# EAGLE design schematic1 (EAGLE 7.2.0)
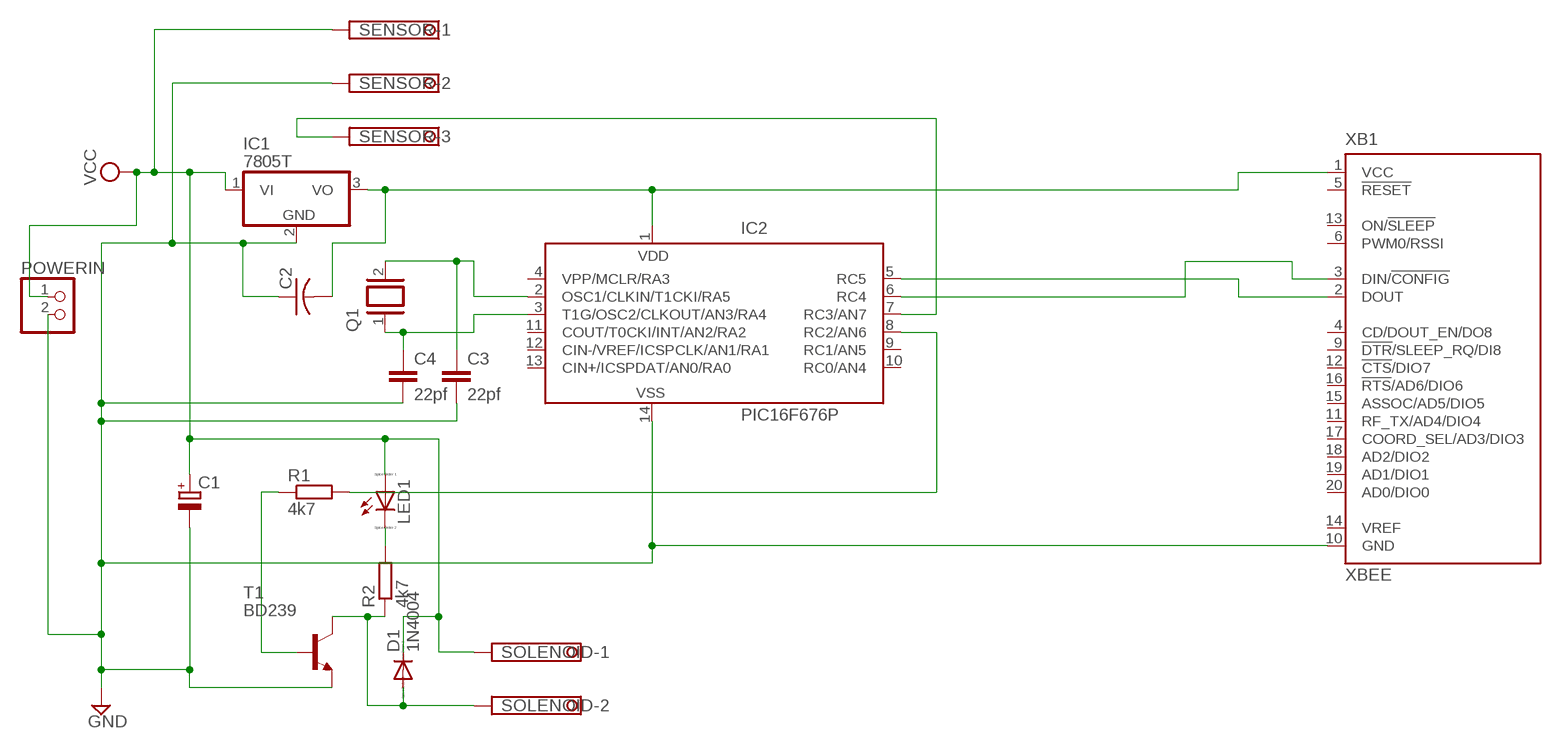
[diagram p0: schematic, sheet 1]

## Parts
C1  CPOL-EUE3.5-8  [E3,5-8]
C2  C-US050-024X044  [C050-024X044]
C3  22pf  C-EU025-025X050  [C025-025X050]
C4  22pf  C-EU025-025X050  [C025-025X050]
D1  1N4004  [DO41-10]
IC1  7805T  [TO220H]
IC2  PIC16F676P  [DIL14]
LED1  LED_ELD260  [LED_LD260]
POWERIN  PINHD-1X2  [1X02]
Q1  XTAL  [Q]
R1  4k7  R-EU_0207/15  [0207/15]
R2  4k7  R-EU_0207/15  [0207/15]
SENSOR  1751251  [1751251]
SOLENOID  1751248  [1751248]
T1  BD239  [TO220]
XB1  XBEE  [XBEE]

## Nets
GND: C1.- C2.1 C3.2 C4.2 IC1.2(GND) IC2.14(VSS) POWERIN.2 SENSOR.2 T1.3(E) XB1.10(GND)
N$1: C2.2 IC1.3(VO) IC2.1(VDD) XB1.1(VCC)
N$2: IC2.8(RC2/AN6) R1.2
N$3: C3.1 IC2.2(OSC1/CLKIN/T1CKI/RA5) Q1.2
N$4: C4.1 IC2.3(T1G/OSC2/CLKOUT/AN3/RA4) Q1.1
N$5: IC2.5(RC5) XB1.2(DOUT)
N$6: IC2.6(RC4) XB1.3(DIN/!CONFIG)
N$7: D1.A R2.1 SOLENOID.2 T1.2(C)
N$8: R1.1 T1.1(B)
N$13: LED1.K(C) R2.2
REGULATOR: IC2.7(RC3/AN7) SENSOR.3
VCC: C1.+ D1.C IC1.1(VI) LED1.A POWERIN.1 SENSOR.1 SOLENOID.1
Unconnected: IC2.4(VPP/MCLR/RA3) IC2.9(RC1/AN5) IC2.10(RC0/AN4) IC2.11(COUT/T0CKI/INT/AN2/RA2) IC2.12(CIN-/VREF/ICSPCLK/AN1/RA1) IC2.13(CIN+/ICSPDAT/AN0/RA0) XB1.4(CD/DOUT_EN/DO8) XB1.5(!RESET) XB1.6(PWM0/RSSI) XB1.9(!DTR!/SLEEP_RQ/DI8) XB1.11(RF_TX/AD4/DIO4) XB1.12(!CTS!/DIO7) XB1.13(ON/!SLEEP) XB1.14(VREF) XB1.15(ASSOC/AD5/DIO5) XB1.16(!RTS!/AD6/DIO6) XB1.17(COORD_SEL/AD3/DIO3) XB1.18(AD2/DIO2) XB1.19(AD1/DIO1) XB1.20(AD0/DIO0)

## Library data of the parts
C1 = rcl:CPOL-EU: POLARIZED CAPACITOR, European symbol
C2 = rcl:C-US: CAPACITOR, American symbol
C3 C4 = rcl:C-EU: CAPACITOR, European symbol
D1 = diode:1N4004: DIODE general purpose rectifier, 1 A
IC1 = linear:78*: Positive VOLTAGE REGULATOR Source: http://cache.national.com/ds/LM/LM78L05.pdf http://www.fairchildsemi.com/ds/LM/LM7805.pdf
IC2 = microchip:PIC16F676: 14-Pin, Flash-Based 8-Bit CMOS Microcontroller High Performance RISC CPU: * Only 35 instructions to learn - All single-cycle instructions except branches * Operating speed: - DC - 20 MHz oscillator/clock input - DC - 200 ns instruction cycle * Internal and external oscillator options - Precision Internal 4 MHz oscillator factory calibrated to ±1% - External Oscillator support for crystals and resonators - 5?s wake-up from SLEEP, 3.0V, typical * Power saving SLEEP mode * Wide operating voltage range - 2.0V to 5.5V * Industrial and Extended temperature range * Low power Power-on Reset (POR) * Power-up Timer (PWRT) and Oscillator Start-up Timer (OST) * Brown-out Detect (BOD) * Watchdog Timer (WDT) with independent oscillator for reliable operation * Multiplexed MCLR/Input-pin * Interrupt-on-pin change * Individual programmable weak pull-ups * Programmable code protection * High Endurance FLASH/EEPROM Cell - 100,000 write FLASH endurance - 1,000,000 write EEPROM endurance - FLASH/Data EEPROM Retention: > 40 years * Standby Current: - 1 nA @ 2.0V, typical * Operating Current: - 8.5?A @ 32 kHz, 2.0V, typical - 100?A @ 1 MHz, 2.0V, typical * Watchdog Timer Current - 300 nA @ 2.0V, typical * Timer1 oscillator current: - 4?A @ 32 kHz, 2.0V, typical * 12 I/O pins with individual direction control * High current sink/source for direct LED drive * Analog-to-Digital Converter module (PIC16F676): - 10-bit resolution - Programmable 8-channel input - Voltage reference input * In-Circuit Serial ProgrammingTM (ICSPTM) via two pins Source: http://ww1.microchip.com/downloads/en/DeviceDoc/40039E.pdf; MF: MICROCHIP; MPN: PIC16F676-I/P; OC_FARNELL: 9760512; OC_NEWARK: 54K2829
LED1 = eagle-ltspice:LED_E: LED Source: http://www.osram.convergy.de Source: www.luxeon.com Source: www.kingbright.com; SPICEMODEL: NONE; SPICEPREFIX: D; SPICETYPE: diode
POWERIN = pinhead:PINHD-1X2: PIN HEADER
Q1 = special:XTAL: CRYSTAL
R1 R2 = resistor:R-EU_: RESISTOR, European symbol
SENSOR = con-phoenix-350:1751251: MKDS 1/ 3-3,5 Printklemme Nennstrom: 10 A Bemessungsspannung: 160 V Raster: 3,5 mm Polzahl: 3 Montageart: Löten Anschlussart: Schraubanschluss Anschlussrichtung vom Leiter zur Platine: 0° Source: http://eshop.phoenixcontact.com .. 1751251.pdf; OC_FARNELL: unknown; OC_NEWARK: unknown
SOLENOID = con-phoenix-350:1751248: MKDS 1/ 2-3,5 Printklemme Nennstrom: 10 A Bemessungsspannung: 160 V Raster: 3,5 mm Polzahl: 2 Montageart: Löten Anschlussart: Schraubanschluss Anschlussrichtung vom Leiter zur Platine: 0° Source: http://eshop.phoenixcontact.com .. 1751248.pdf; OC_FARNELL: unknown; OC_NEWARK: unknown
T1 = transistor-neu-to92:BD239: NPN TRANSISTOR Source: http://www.fairchildsemi.com/ds/BD/BD239C.pdf
XB1 = maxstream:XBEE: XBee (TM) /XBee-PRO(TM) OEM RF Modules Source: MaxStream, Inc. xbee_productmanual.pdf; MPN: XBP24-Z7UIT-004; OC_FARNELL: 1751799; OC_NEWARK: 34R5507

## Board
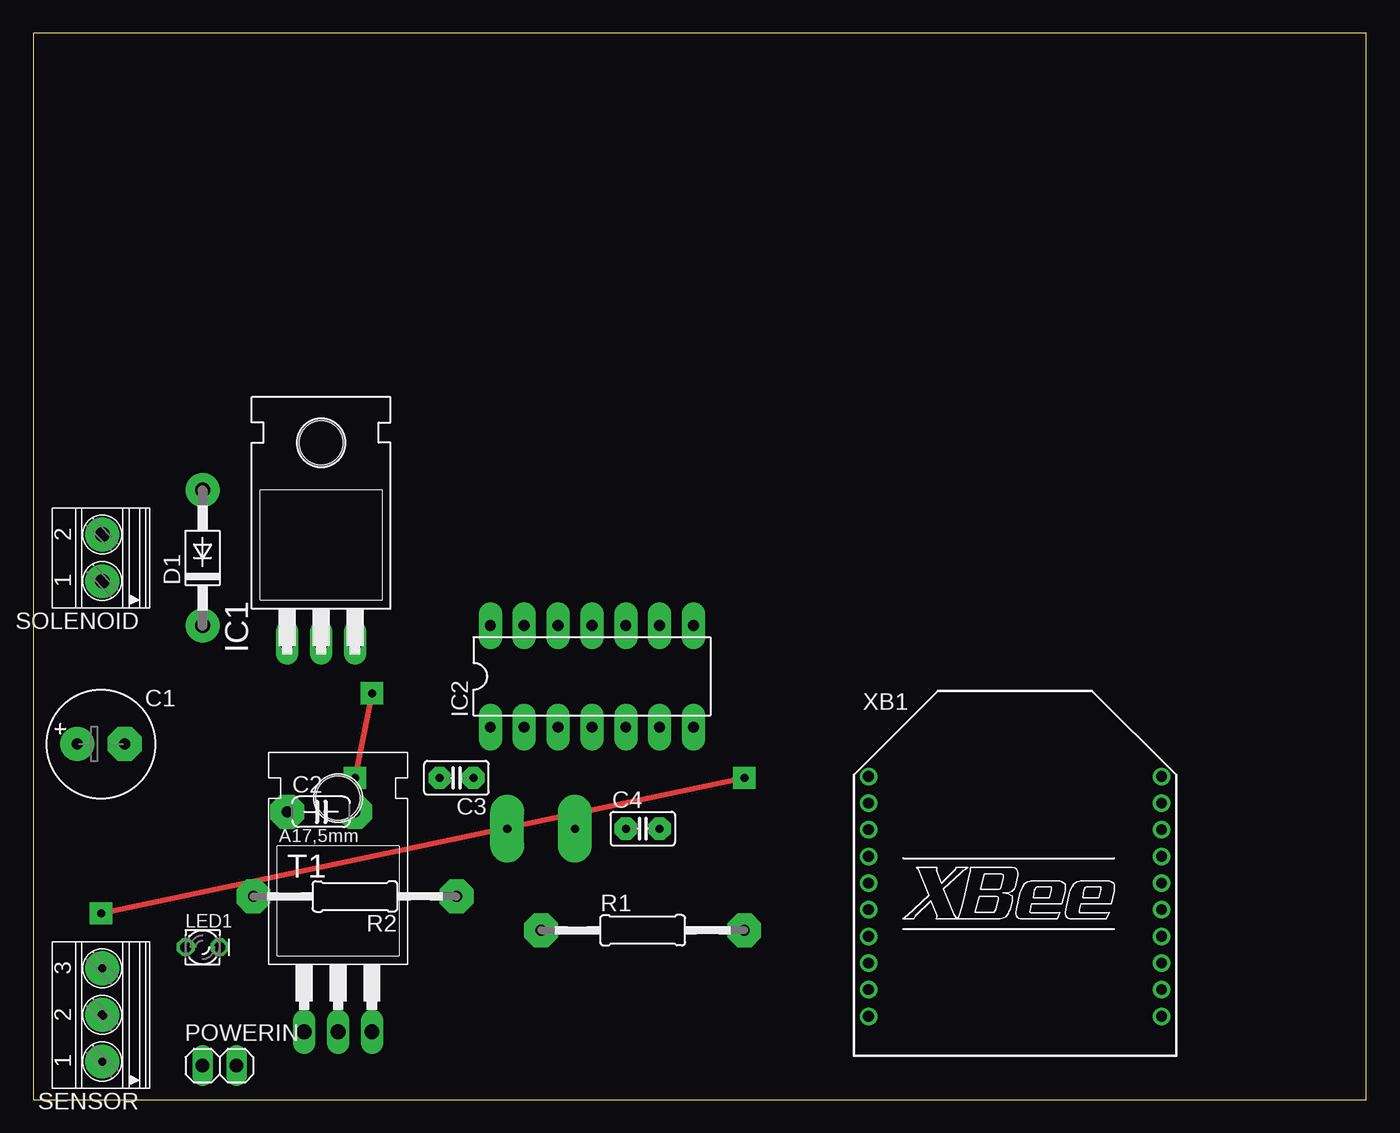
[diagram p1: board, top side]
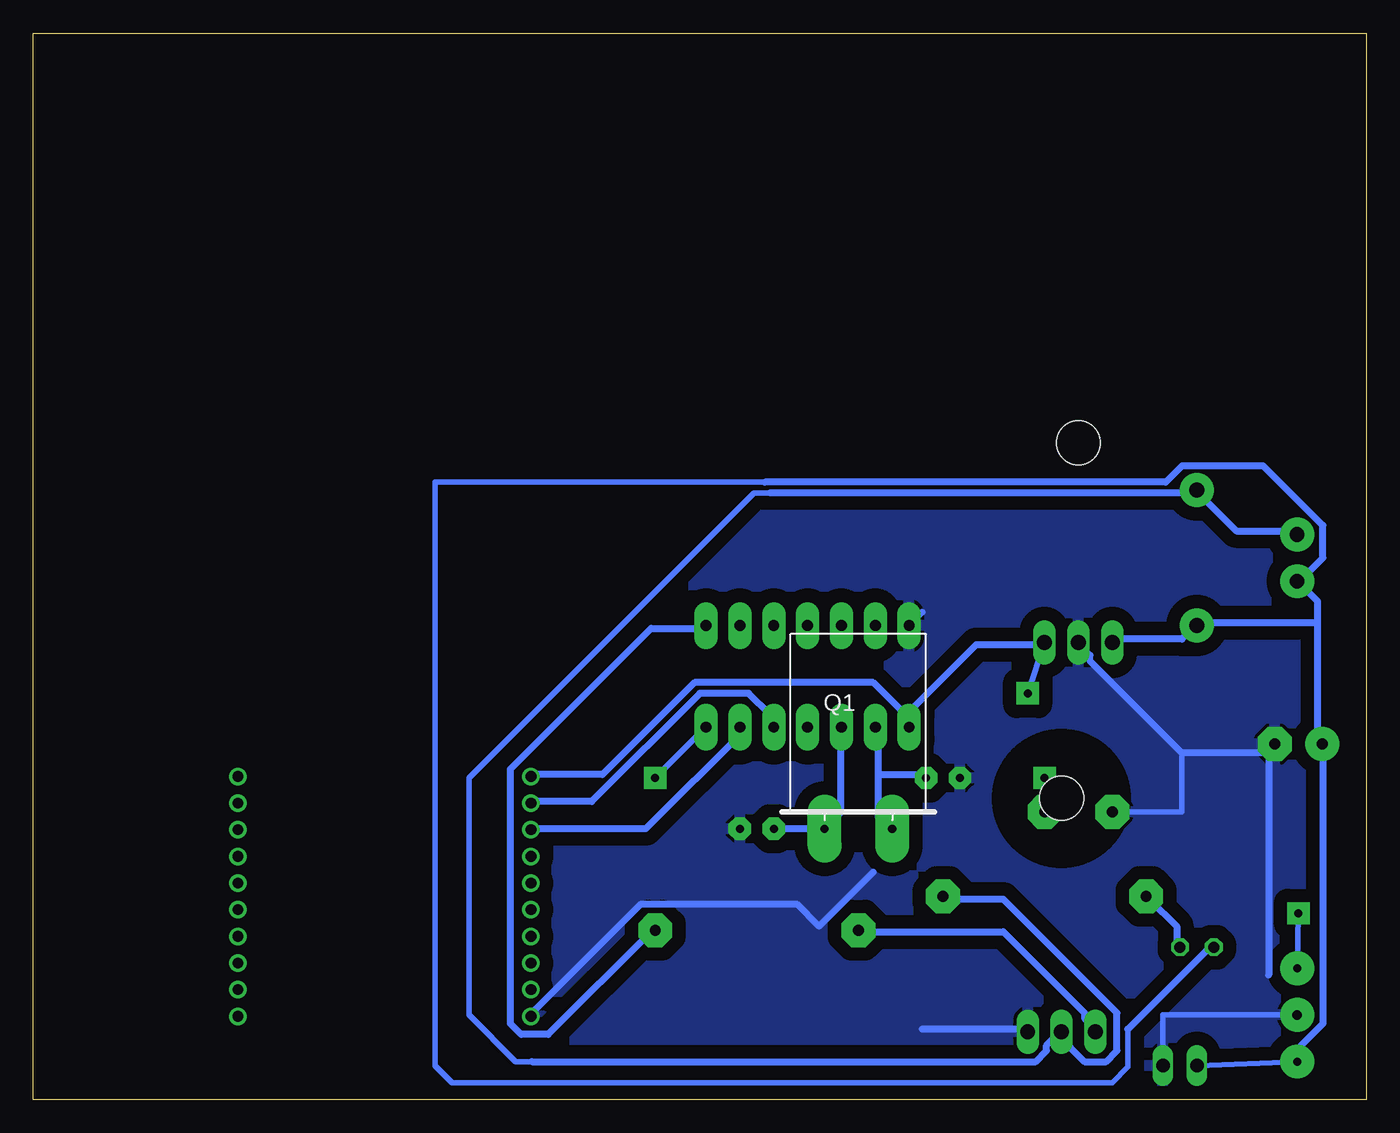
[diagram p2: board, bottom side, seen from below]

Size 100 x 80 mm. Coordinates in mm from the lower left corner, seen from the top.
Outline: 0,0 100,0 100,80 0,80 0,0
Copper layers (1*16): Top 0.035mm / dielectric 1.5mm / Bottom 0.035mm
Design rules "default *": minimum track width 20mil, minimum drill 14mil, track to track 12mil, track to pad 12mil, pad to pad 12mil, via to via 8mil, smd to smd 8mil, copper to edge 40mil, drill to drill 8mil, minimum pad ring 10mil, minimum via ring 8mil, stop-mask expansion 4mil, vias tented up to drill 0mil, thermal gap 10mil

### Footprints (pad centres in the part's own frame; a part is rotated, then mirrored left to right if it is on the bottom)
E3,5-8 = drill 0.813 pad 2.54: + -1.778,0 | drill 0.813 pad 2.54 octagon: - 1.778,0
C050-024X044 = drill 0.813 pad 2.54 octagon: 1 -2.54,0; 2 2.54,0
C025-025X050 = drill 0.6 pad 1.676 octagon: 1 -1.27,0; 2 1.27,0
DO41-10 = drill 1.118 pad 2.54: A 5.08,0; C -5.08,0
TO220H = drill 1.118 long: 1 -2.54,-10.16; 2 0,-10.16; 3 2.54,-10.16 | hole 3.302: 0,4.826
DIL14 = drill 0.813 pad 1.778 long: 1 -7.62,-3.81; 2 -5.08,-3.81; 3 -2.54,-3.81; 4 0,-3.81; 5 2.54,-3.81; 6 5.08,-3.81; 7 7.62,-3.81; 8 7.62,3.81; 9 5.08,3.81; 10 2.54,3.81; 11 0,3.81; 12 -2.54,3.81; 13 -5.08,3.81; 14 -7.62,3.81
LED_LD260 = drill 0.813 octagon: A -1.27,0; K 1.27,0
1X02 = drill 1.016 long: 1 -1.27,0; 2 1.27,0
Q = drill 0.61 pad 2.54 long: 1 -2.54,-7.62; 2 2.54,-7.62
0207/15 = drill 0.813 pad 2.54 octagon: 1 -7.62,0; 2 7.62,0
1751251 = drill 0.6 pad 2.54: 1 -3.5,-0.1; 3 3.5,-0.1 | drill 0.7 pad 2.54: 2 0,-0.1
1751248 = drill 1.1 pad 2.54: 1 -1.75,-0.1; 2 1.75,-0.1
TO220 = drill 1.118 long: 1 -2.54,-6.35; 2 0,-6.35; 3 2.54,-6.35 | hole 3.302: 0,11.176
XBEE = drill 0.8 pad 1.27: 1 -11,9; 2 -11,7; 3 -11,5; 4 -11,3; 5 -11,1; 6 -11,-1; 7 -11,-3; 8 -11,-5; 9 -11,-7; 10 -11,-9; 11 11,-9; 12 11,-7; 13 11,-5; 14 11,-3; 15 11,-1; 16 11,1; 17 11,3; 18 11,5; 19 11,7; 20 11,9

### Placement (x,y rotation side)
C1  5.08,26.67 0 top
C2  21.59,21.59 0 top
C3  31.75,24.13 180 top
C4  45.72,20.32 0 top
D1  12.7,40.64 90 top
IC1  21.59,44.45 0 top
IC2  41.91,31.75 0 top
LED1  12.7,11.43 0 top
POWERIN  13.97,2.54 0 top
Q1  38.1,27.94 0 bottom
R1  45.72,12.7 0 top
R2  24.13,15.24 180 top
SENSOR  5.08,6.35 90 top
SOLENOID  5.08,40.64 90 top
T1  22.86,11.43 0 top
XB1  73.66,15.24 0 top

### Tracks (layer width: path | path; a pad name or v marks a point on that pad's centre or on a via)
GND
  Bottom 0.406: C2.1 13.82,21.59 13.82,26.01 | POWERIN.2 15.24,6.35 SENSOR.2
  Bottom 0.508: 33.33,5.28 25.6,5.28 T1.3 | XB1.10 62.59,6.5 54.46,14.63 42.67,14.63 41.05,13.01 36.98,17.07 | 21.95,34.95 21.95,34.54 IC1.2 21.54,34.14 20.73,33.33 20.73,32.92 13.82,26.01 7.32,26.01 | 33.33,36.58 34.14,35.76 IC2.14 | 5.28,7.32 5.28,6.5 SENSOR.2 | 7.32,26.01 7.32,9.35 | 7.32,26.01 6.91,26.42 C1.- 7.32,26.01
  pour Bottom (isolate 1.016): 0,49.53 87.63,49.53 87.63,1.27 87.63,0 0,0 0,2.54
N$1  (via drill 0.6 pad 1.68)
  Top 0.406: v25.4,30.48 v24.13,24.13
  Bottom 0.406: IC1.3 v25.4,30.48 | v24.13,24.13 C2.2
  Bottom 0.508: 34.54,28.85 36.98,31.29 50.39,31.29 57.3,24.38 62.59,24.38 XB1.1 | 34.54,28.85 34.54,28.04 IC2.1 34.54,28.85 | 34.54,28.85 29.26,34.14 24.38,34.14 IC1.3
N$2
  Bottom 0.508: IC2.8 49.58,35.36 53.65,35.36 64.21,24.79 64.21,5.69 63.4,4.88 61.37,4.88 53.65,12.6 R1.2
N$3
  Bottom 0.508: 36.58,24.38 36.58,21.13 35.76,20.32 Q1.2 | 36.58,24.38 36.58,27.64 IC2.2 | 36.58,24.38 33.33,24.38 C3.1
N$4
  Bottom 0.508: IC2.3 39.42,27.64 39.42,21.54 Q1.1 C4.1
N$5
  Bottom 0.508: XB1.2 62.59,22.35 58.12,22.35 49.99,30.48 46.33,30.48 44.7,28.85 44.7,28.04 IC2.5
N$6
  Bottom 0.508: XB1.3 62.59,20.32 54.05,20.32 46.74,27.64 IC2.6
N$7
  Bottom 0.406: 44.7,45.52 45.92,45.52 67.31,24.13 67.31,6.35 63.8,2.85 62.59,2.85
  Bottom 0.508: 23.16,4.88 23.98,4.06 23.98,3.66 24.79,2.85 62.59,2.85 | 44.7,45.52 13.01,45.52 D1.A 12.6,45.52 9.75,42.67 5.28,42.67 SOLENOID.2 | 23.16,4.88 21.13,2.85 19.51,2.85 18.69,3.66 18.69,6.5 27.23,15.04 31.7,15.04 R2.1 | 23.16,4.88 T1.2
N$8
  Bottom 0.508: T1.1 20.32,5.28 21.13,6.1 21.13,6.5 27.23,12.6 37.8,12.6 R1.1
N$10  (via drill 0.6 pad 1.68)
  other vias: 25.4,30.48
N$11  (via drill 0.6 pad 1.68)
  other vias: 24.13,24.13
N$12  (via drill 0.6 pad 1.68)
  other vias: 5.08,13.97
N$13
  Bottom 0.508: LED1.K 14.22,11.79 14.22,13.01 16.26,15.04 R2.2
REGULATOR  (via drill 0.6 pad 1.68)
  Top 0.406: v5.08,13.97 v53.34,24.13
  Bottom 0.406: IC2.7 v53.34,24.13 | SENSOR.3 v5.08,13.97
VCC
  Bottom 0.406: POWERIN.1 SENSOR.1 | 45.11,46.33 69.85,46.33 69.85,2.54 68.58,1.27 19.05,1.27 17.88,2.44 17.88,5.28
  Bottom 0.508: IC1.1 18.69,34.54 13.82,34.54 13.01,35.36 D1.C 12.6,35.76 3.66,35.76 | 3.66,35.76 3.66,37.39 4.88,38.61 SOLENOID.1 4.88,39.01 3.25,40.64 3.25,43.08 7.72,47.55 13.82,47.55 15.04,46.33 45.11,46.33 | 3.66,35.76 3.66,26.82 C1.+ 3.25,26.42 3.25,5.69 4.88,4.06 4.88,3.25 SENSOR.1 | 17.88,5.28 11.79,11.38 LED1.A